# EAGLE design BB2LLOAD_TG16 (EAGLE 6.6.0)
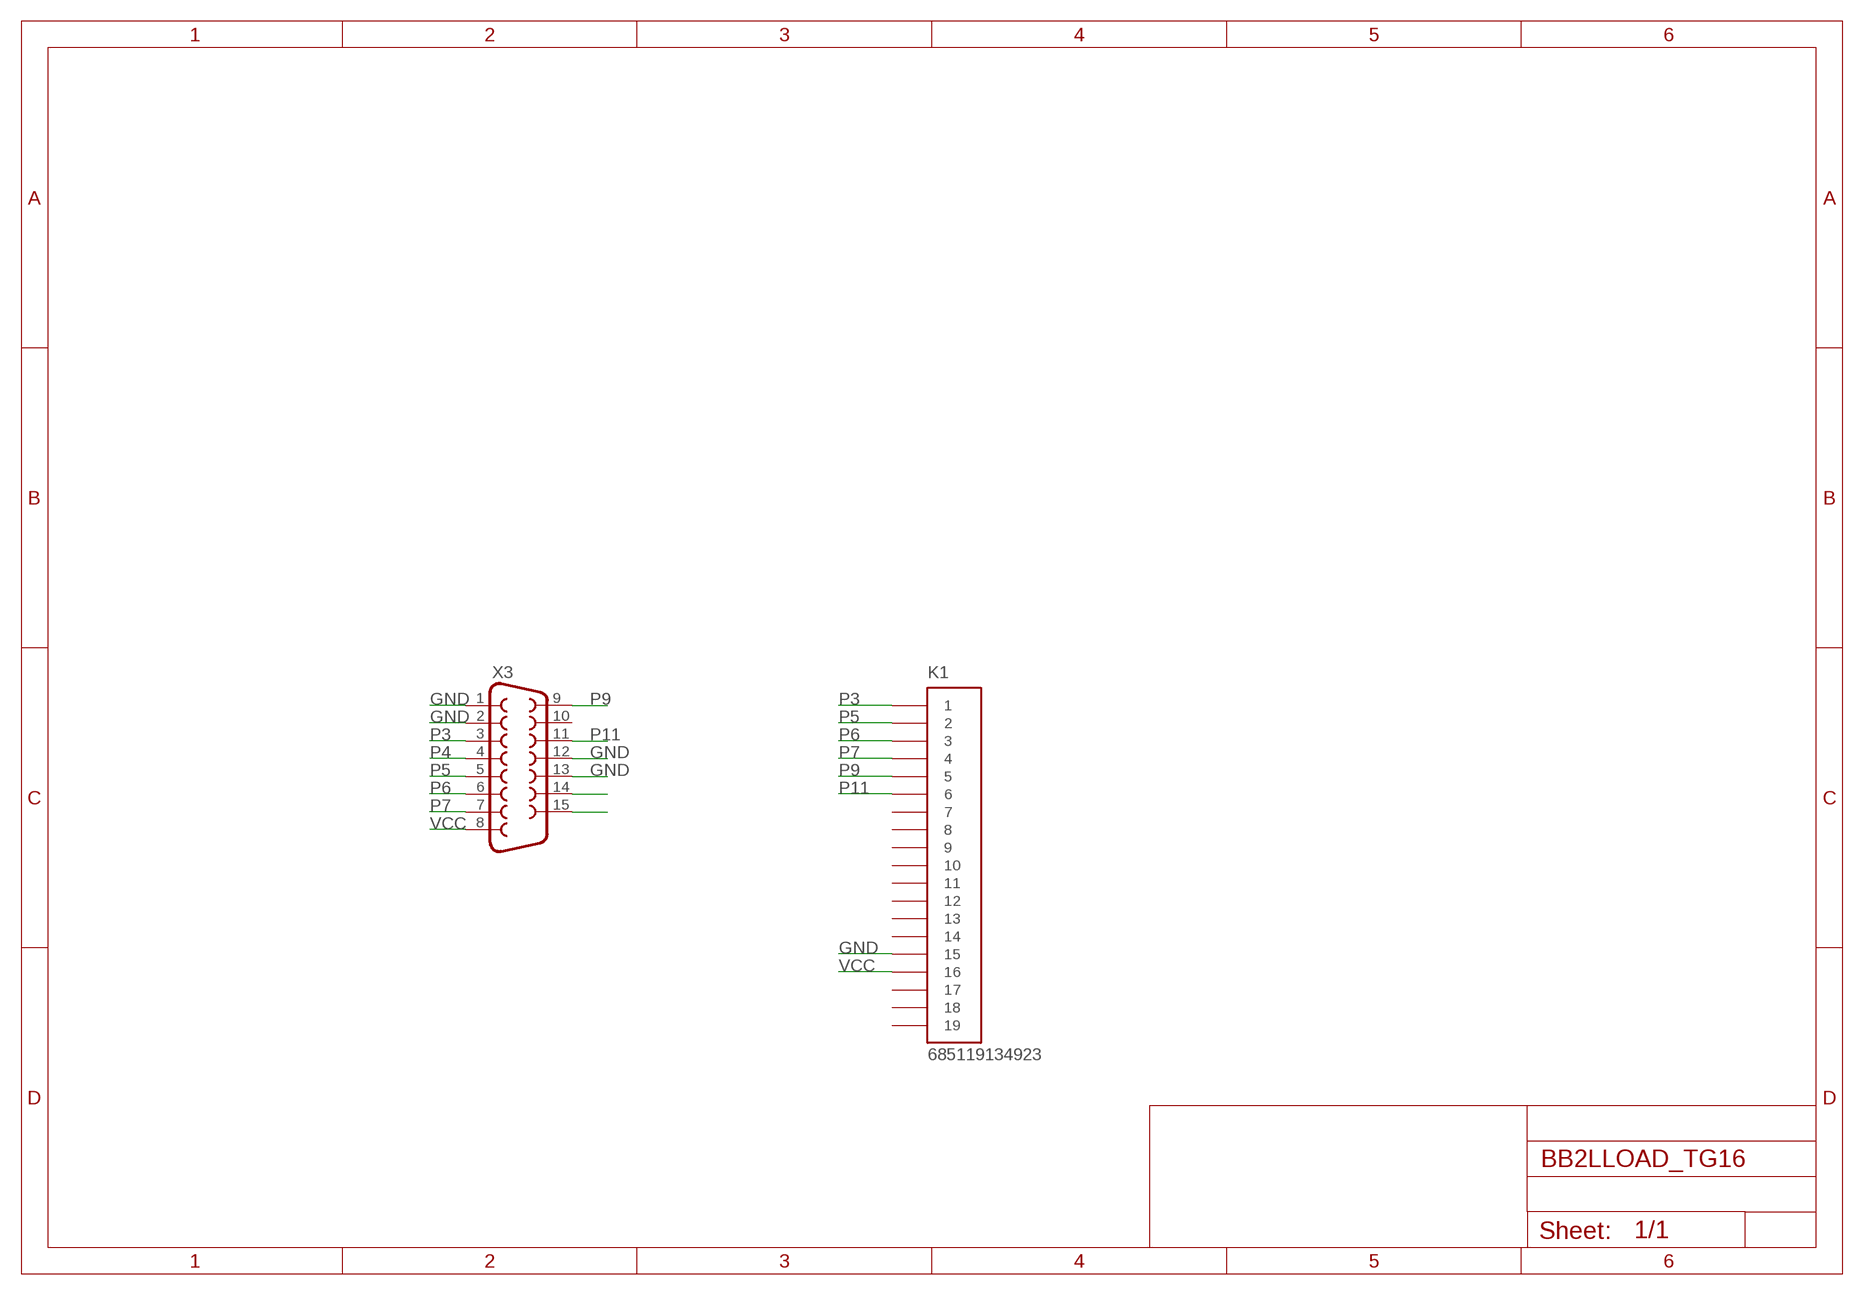
[diagram p0: schematic, sheet 1]

## Parts
K1  685119134923  [685119134923]
X3  F15HP  [F15HP]

## Nets
GND: K1.15 X3.1 X3.2 X3.12 X3.13
N$3: X3.14
N$4: X3.15
P3: K1.1 X3.3
P4: X3.4
P5: K1.2 X3.5
P6: K1.3 X3.6
P7: K1.4 X3.7
P9: K1.5 X3.9
P11: K1.6 X3.11
VCC: K1.16 X3.8
Unconnected: K1.7 K1.8 K1.9 K1.10 K1.11 K1.12 K1.13 K1.14 K1.17 K1.18 K1.19 X3.10

## Library data of the parts
K1 = wuerth:685119134923: WR-COM SMT Horizontal HDMI, 19 pins
X3 = con-subd:F15: SUB-D; OC_FARNELL: unknown; OC_NEWARK: unknown

## Board
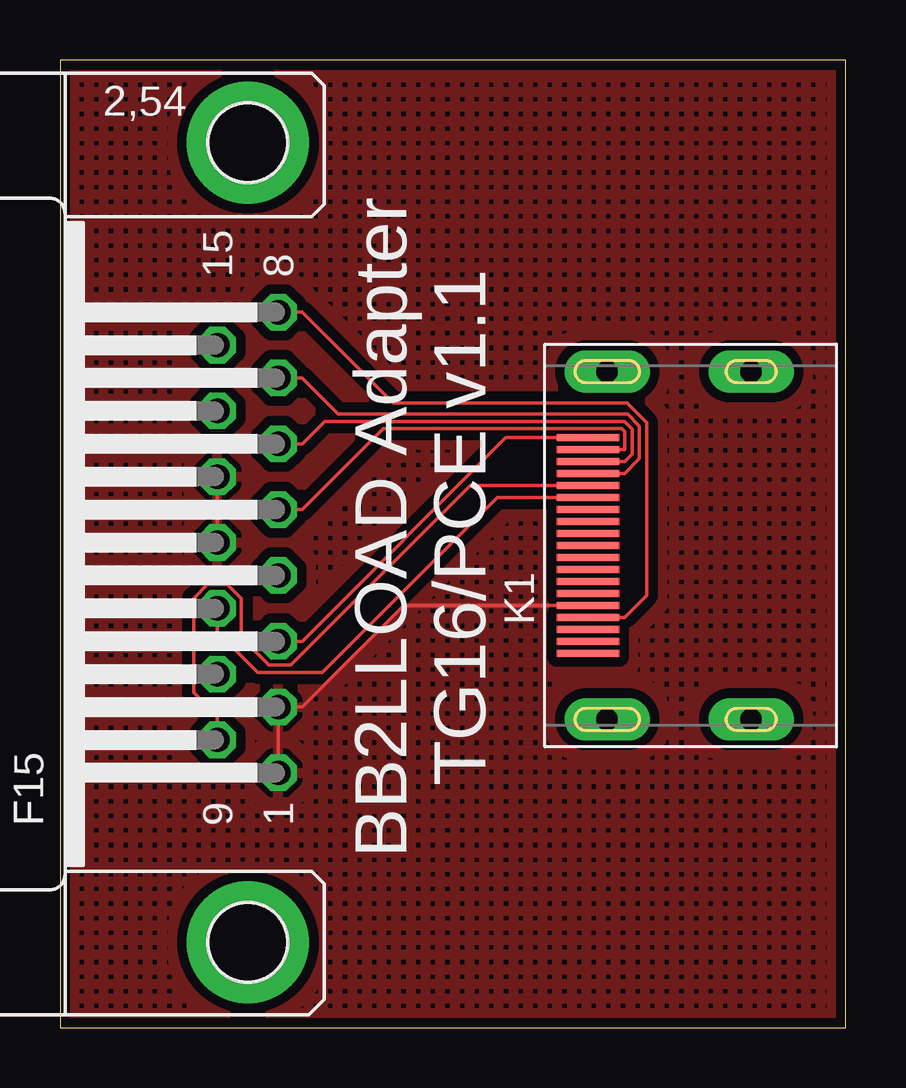
[diagram p1: board, top side]
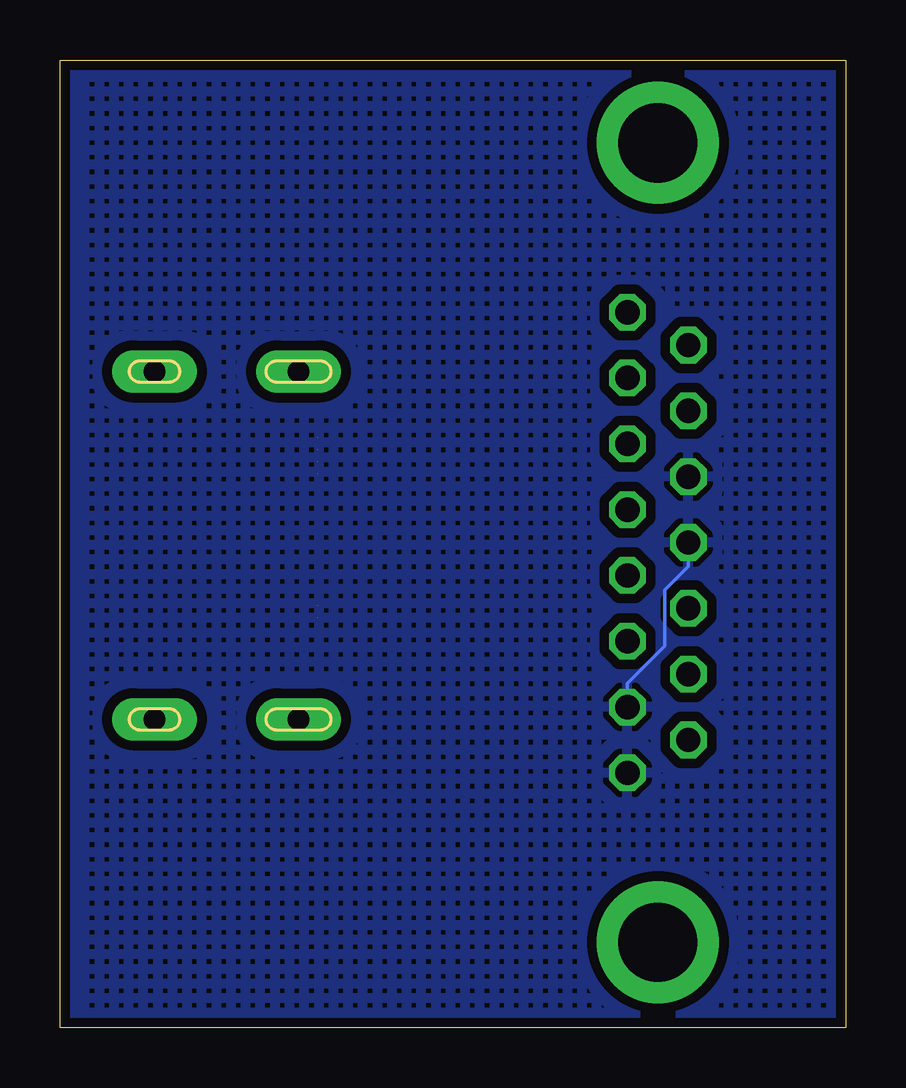
[diagram p2: board, bottom side, seen from below]

Size 32.74 x 40.34 mm. Coordinates in mm from the lower left corner, seen from the top.
Outline: 0,40.34 0,0 32.74,0 32.74,40.34 0,40.34
Copper layers (1*16): Top 0.035mm / dielectric 1.5mm / Bottom 0.035mm
Design rules "SeeedStudio_2layer_DRU_no_angle_20140221": minimum track width 6mil, minimum drill 12mil, track to track 6mil, track to pad 6mil, pad to pad 6mil, via to via 6mil, smd to smd 0mil, copper to edge 10mil, drill to drill 10mil, minimum pad ring 10mil, minimum via ring 6mil, stop-mask expansion 2mil, vias tented up to drill 100mil, thermal gap 10mil

### Footprints (pad centres in the part's own frame; a part is rotated, then mirrored left to right if it is on the bottom)
685119134923 = smd 0.28 x 2.6: 1 4.5,0; 2 4,0; 3 3.5,0; 4 3,0; 5 2.5,0; 6 2,0; 7 1.5,0; 8 1,0; 9 0.5,0; 10 0,0; 11 -0.5,0; 12 -1,0; 13 -1.5,0; 14 -2,0; 15 -2.5,0; 16 -3,0; 17 -3.5,0; 18 -4,0; 19 -4.5,0 | drill 0.9 pad 1.778 long: Z1 -7.25,-0.8; Z2 -7.25,-6.8; Z3 7.25,-6.8; Z4 7.25,-0.8
F15HP = drill 1.016 octagon: 1 -9.601,-1.27; 2 -6.858,-1.27; 3 -4.115,-1.27; 4 -1.372,-1.27; 5 1.372,-1.27; 6 4.115,-1.27; 7 6.858,-1.27; 8 9.601,-1.27; 9 -8.23,1.27; 10 -5.486,1.27; 11 -2.743,1.27; 12 0,1.27; 13 2.743,1.27; 14 5.486,1.27; 15 8.23,1.27 | drill 3.302 pad 5.08: G1 -16.662,0; G2 16.662,0

### Placement (x,y rotation side)
K1  22,20.1 90 top
X3  7.83,20.22 90 top

### Tracks (layer width: path | path; a pad name or v marks a point on that pad's centre or on a via)
GND  (1 unrouted)
  Top 0.152: K1.15 14.32,17.6 10.09,13.36 X3.2 X3.1 | X3.13 X3.12
  Bottom 0.152: X3.2 9.1,14.35 7.55,15.9 7.55,18.24 6.56,19.23 X3.12
  pour Top (isolate 0.406, hatched): 0,40.4 32.75,40.4 32.75,-0.15 0,-0.15
  pour Bottom (isolate 0.406, hatched): 0,40.55 32.9,40.55 32.9,-0.3 0,-0.3
P3  (1 unrouted)
  Top 0.152: X3.3 10.09,16.11 18.58,24.6 K1.1
P5  (1 unrouted)
  Top 0.152: K1.2 23.53,24.1 23.53,24.84 23.4,24.97 13.46,24.97 10.09,21.59 X3.5
P6  (1 unrouted)
  Top 0.152: X3.6 10.09,24.34 11.03,25.27 23.52,25.27 23.84,24.96 23.84,23.91 23.53,23.6 K1.3
P7  (1 unrouted)
  Top 0.152: K1.4 23.53,23.1 24.14,23.71 24.14,25.09 23.65,25.58 11.59,25.58 10.09,27.08 X3.7
P9
  Top 0.152: X3.9 6.56,12.98 5.57,13.97 5.57,17.89 6.14,18.47 6.97,18.47 7.55,17.89 7.55,16.25 8.69,15.12 9.62,15.12 17.1,22.6 K1.5
P11
  Top 0.152: K1.6 18.22,22.1 10.93,14.81 8.23,14.81 6.56,16.49 X3.11
VCC  (1 unrouted)
  Top 0.152: K1.16 23.53,17.1 24.45,18.02 24.45,25.21 23.63,26.03 13.88,26.03 10.09,29.82 X3.8

### Text on the board
tPlace: BB2LLOAD Adapter / TG16/PCE v1.1